# EAGLE design PCB-PWR-CON2 (EAGLE 6.4)
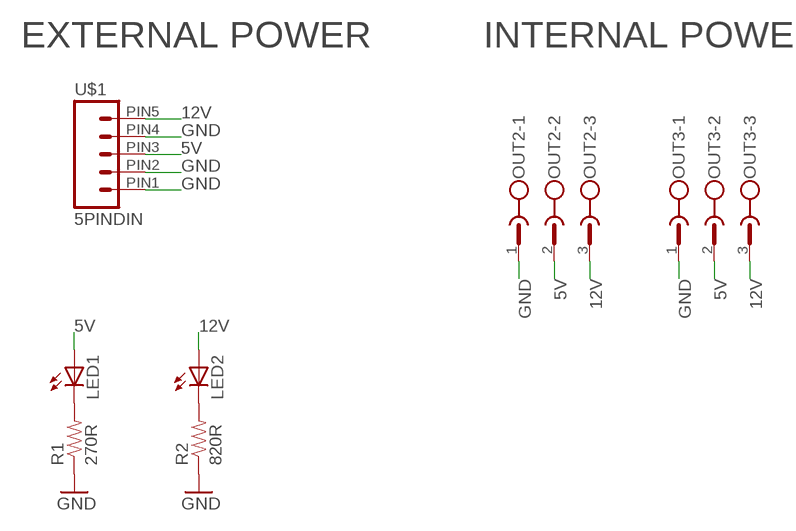
[diagram p0: schematic, sheet 1]

## Parts
LED1  LED3MM  [LED3MM]
LED2  LED3MM  [LED3MM]
OUT2  CON1  MSTBV3  [MSTBV3]
OUT3  CON1  MSTBV3  [MSTBV3]
R1  270R  RESISTOR0603-RES  [0603-RES]
R2  820R  RESISTOR0603-RES  [0603-RES]
U$1  5PINDIN  [5PINDIN]

## Nets
5V [PWR]: LED1.A OUT2.2 OUT3.2 U$1.PIN3
12V [PWR]: LED2.A OUT2.3 OUT3.3 U$1.PIN5
GND [PWR]: OUT2.1 OUT3.1 R1.1 R2.1 U$1.PIN1 U$1.PIN2 U$1.PIN4
N$1: LED1.K(C) R1.2
N$2: LED2.K(C) R2.2

## Notes on the sheet
- EXTERNAL POWER | INTERNAL POWER

## Library data of the parts
LED1 LED2 = SparkFun:LED: LEDs Standard schematic elements and footprints for 5mm, 3mm, 1206, and 0603 sized LEDs. 5mm - Spark Fun Electronics SKU : COM-00529 (and others)
OUT2 OUT3 = con-phoenix-508:MSTBV3: PHOENIX; MPN: MSTBV 2,5/3-GF-5.08; OC_FARNELL: 1792793; OC_NEWARK: 69R9846
R1 R2 = SparkFun:RESISTOR: Resistor Basic schematic elements and footprints for 0603, 1206, and PTH resistors.
U$1 = SKAARHOJ:5PINDIN

## Net classes
0 default: width 0.254 mm, drill 0.406 mm, clearance 0.254 mm
1 PWR: width 0.406 mm, drill 0.61 mm, clearance 0.254 mm

## Board
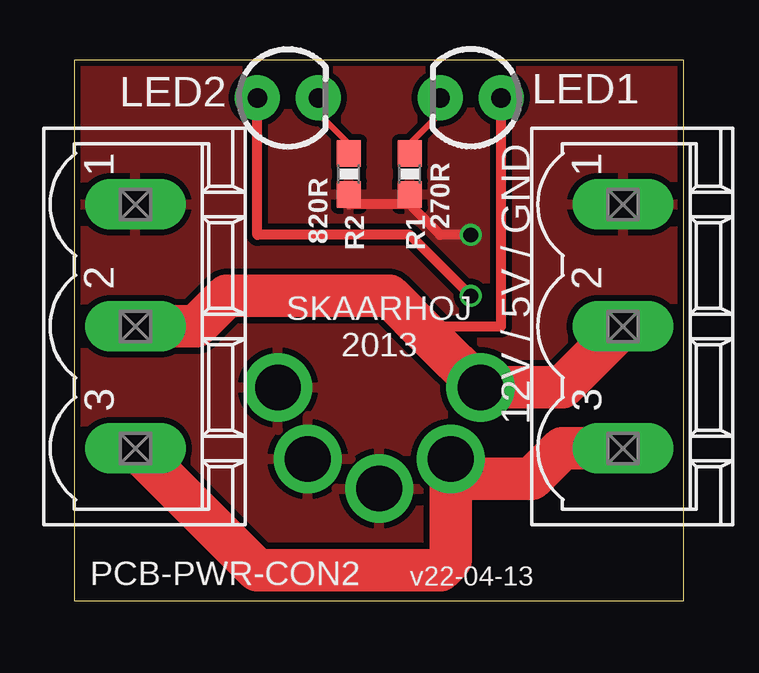
[diagram p1: board, top side]
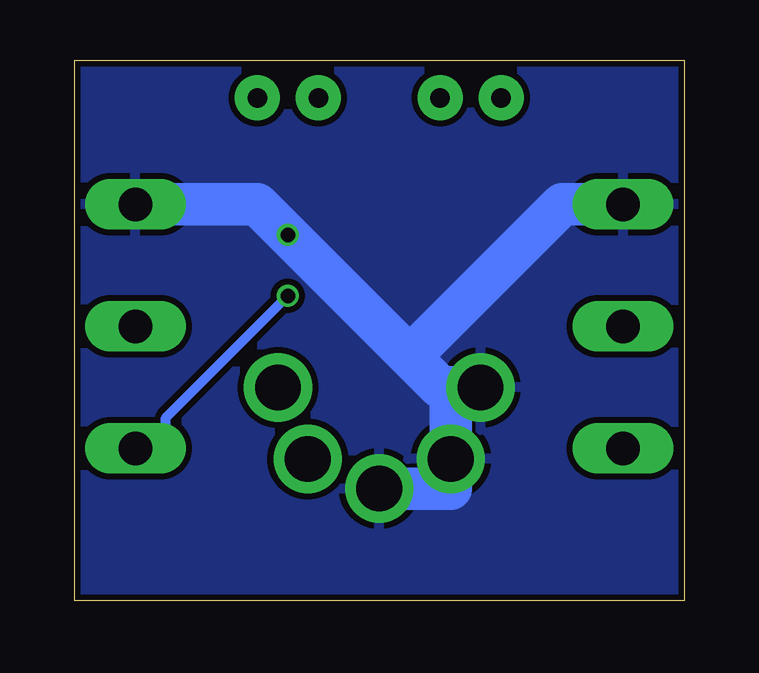
[diagram p2: board, bottom side, seen from below]

Size 25.38 x 22.53 mm. Coordinates in mm from the lower left corner, seen from the top.
Outline: 0,0 25.38,0 25.38,22.53 0,22.53 0,0
Copper layers (1*16): Top 0.035mm / dielectric 1.5mm / Bottom 0.035mm
Design rules "Fusion_eagle_rule_v1.1": minimum track width 6mil, minimum drill 12mil, track to track 6mil, track to pad 6mil, pad to pad 6mil, via to via 6mil, smd to smd 0mil, copper to edge 10mil, drill to drill 10mil, minimum pad ring 10mil, minimum via ring 6mil, stop-mask expansion 2mil, vias tented up to drill 100mil, thermal gap 10mil

### Footprints (pad centres in the part's own frame; a part is rotated, then mirrored left to right if it is on the bottom)
LED3MM = drill 0.813 pad 1.88: A -1.27,0; K 1.27,0
MSTBV3 = drill 1.397 long: 1 -5.08,0; 2 0,0; 3 5.08,0
0603-RES = smd 1.1 x 1: 1 -0.85,0; 2 0.85,0
5PINDIN = drill 1.9: PIN1 4.22,0; PIN2 0,4.22; PIN3 -4.22,0; PIN4 2.98,2.98; PIN5 -2.98,2.98

### Placement (x,y rotation side)
LED1  16.51,20.95 180 top
LED2  8.89,20.95 0 top
OUT2  2.54,11.43 270 top
OUT3  22.86,11.43 270 top
R1  13.97,17.78 90 top
R2  11.43,17.78 90 top
U$1  12.7,8.89 180 top

### Tracks (layer width: path | path; a pad name or v marks a point on that pad's centre or on a via)
5V
  Top 0.406: LED1.A 17.78,11.43 15.24,11.43 14.81,11
  Top 1.778: OUT2.2 5.08,11.43 6.35,12.7 13.11,12.7 14.81,11 U$1.PIN3 20.32,8.89 OUT3.2
12V  (via drill 0.61)
  Top 0.406: LED2.A 7.62,15.24 13.97,15.24 v16.51,12.7
  Top 1.778: OUT3.3 20.32,6.35 19.05,5.08 16.51,5.08 U$1.PIN5 15.68,1.71 15.24,1.27 7.62,1.27 OUT2.3
  Bottom 0.406: v16.51,12.7 21.59,7.62 21.59,6.35 OUT3.3
GND  (via drill 0.61)
  Top 0.406: 13.97,16.51 11.43,16.51 R2.1 | 13.97,16.51 15.24,15.24 v16.51,15.24 | 13.97,16.51 R1.1
  Bottom 1.778: U$1.PIN2 9.72,4.67 U$1.PIN4 9.72,8.89 U$1.PIN1 10.16,8.89 11.43,10.16 | 11.43,10.16 v16.51,15.24 17.78,16.51 OUT3.1 | OUT2.1 5.08,16.51 11.43,10.16
  pour Top: 0,0 25.4,0 25.4,22.86 0,22.86
  pour Bottom: 0,0 25.4,0 25.4,22.86 0,22.86
N$1
  Top 0.254: R1.2 13.97,19.05 15.24,20.32 LED1.K
N$2
  Top 0.254: R2.2 11.43,19.05 10.16,20.32 LED2.K

### Text on the board
_tsilk: 12V / 5V / GND | SKAARHOJ / 2013 | PCB-PWR-CON2 | v22-04-13